# Altium schematic sheet DAP_Main.SchDoc
size A4
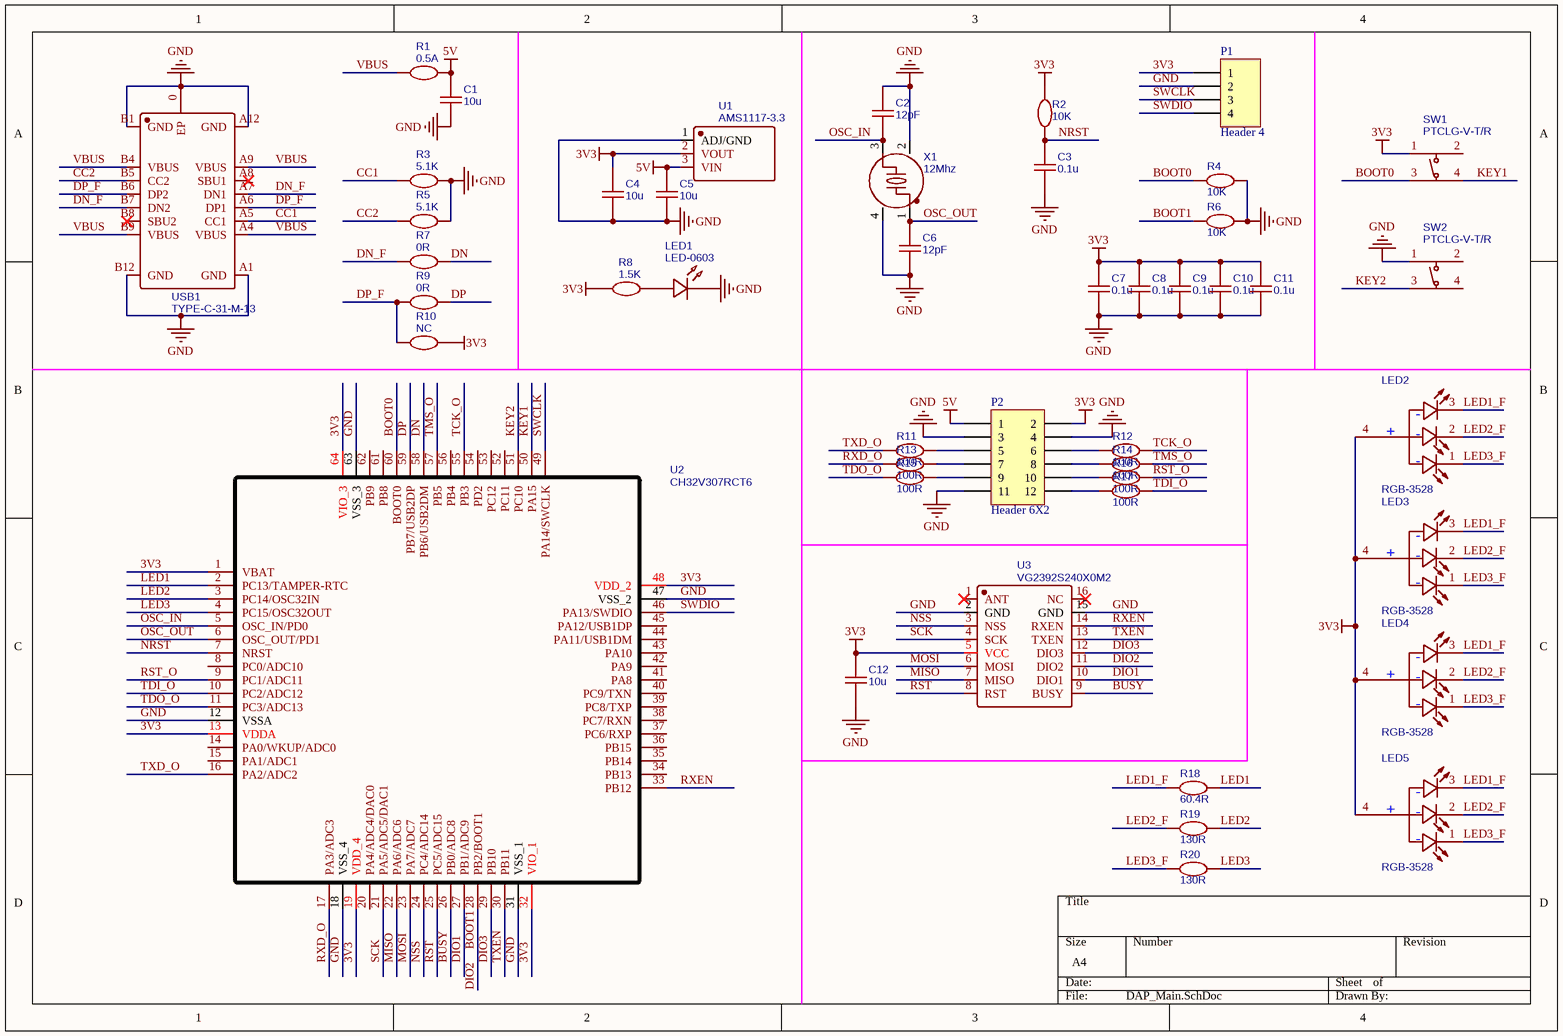
[diagram p0: DAP_Main.SchDoc]

## Parts
C1  10u  [0603_CAP]
C2  12pF  [0402_CAP]
C3  0.1u  [0402_CAP]
C4  10u  [0603_CAP]
C5  10u  [0603_CAP]
C6  12pF  [0402_CAP]
C7  0.1u  [0402_CAP]
C8  0.1u  [0402_CAP]
C9  0.1u  [0402_CAP]
C10  0.1u  [0402_CAP]
C11  0.1u  [0402_CAP]
C12  10u  [0603_CAP]
LED1  LED-0603  [LED0603_RED]
LED2  RGB-3528  [LED-ARRAY-SMD_3528-4P-L3.5-W2.8-TL-RD]
LED3  RGB-3528  [LED-ARRAY-SMD_3528-4P-L3.5-W2.8-TL-RD]
LED4  RGB-3528  [LED-ARRAY-SMD_3528-4P-L3.5-W2.8-TL-RD]
LED5  RGB-3528  [LED-ARRAY-SMD_3528-4P-L3.5-W2.8-TL-RD]
P1  Header 4  [PAD_2.54_1X4]
P2  Header 6X2  [PAD_2.54_2x6_M]
R1  0.5A  [0603_RES]
R2  10K  [0402_RES]
R3  5.1K  [0402_RES]
R4  10K  [0402_RES]
R5  5.1K  [0402_RES]
R6  10K  [0402_RES]
R7  0R  [0402_RES]
R8  1.5K  [0402_RES]
R9  0R  [0402_RES]
R10  NC  [0402_RES]
R11  100R  [0402_RES]
R12  100R  [0402_RES]
R13  100R  [0402_RES]
R14  100R  [0402_RES]
R15  100R  [0402_RES]
R16  100R  [0402_RES]
R17  100R  [0402_RES]
R18  60.4R  [0603_RES]
R19  130R  [0603_RES]
R20  130R  [0603_RES]
SW1  PTCLG-V-T/R  [SW-SMD_4P-L4.7-W3.5-P1.70-LS5.9]
SW2  PTCLG-V-T/R  [SW-SMD_4P-L4.7-W3.5-P1.70-LS5.9]
U1  AMS1117-3.3  [SOT-89-3_L4.5-W2.5-P1.50-LS4.2-BR]
U2  CH32V307RCT6  [CH32V307RCRT6]
U3  VG2392S240X0M2  [WIRELM-SMD_16P-L24.0-W16.0-P2.00_VG2392S240X0M2]
USB1  TYPE-C-31-M-13  [USB-C-SMD_TYPE-C-31-M-13]
X1  12Mhz  [XTAL3225]

## Nets
3V3: C4.1 C7.1 C8.1 C9.1 C10.1 C11.1 C12.1 LED2.4 LED3.4 LED4.4 LED5.4 P1.1 P2.2 R2.2 R8.1 R10.2 SW1.1 U1.2(VOUT) U2.1(VBAT) U2.13(VDDA) U2.19(VDD_4) U2.32(VIO_1) U2.48(VDD_2) U2.64(VIO_3) U3.5(VCC)
5V: C1.2 C5.2 P2.1 R1.2 U1.3(VIN)
GND: C1.1 C2.2 C3.2 C4.2 C5.1 C6.1 C7.2 C8.2 C9.2 C10.2 C11.2 C12.2 LED1.2 P1.2 P2.3 P2.4 P2.11 R3.2 R4.1 R5.2 R6.1 SW2.1 U1.1(ADJ/GND) U2.12(VSSA) U2.18(VSS_4) U2.31(VSS_1) U2.47(VSS_2) U2.63(VSS_3) U3.2(GND) U3.15(GND) USB1.0(EP) USB1.A1(GND) USB1.A12(GND) USB1.B1(GND) USB1.B12(GND) X1.2(GND) X1.4(GND)
BOOT0: R4.2 SW1.3 U2.60(BOOT0)
BOOT1: R6.2 U2.28(PB2/BOOT1) U3.11(DIO2)  [also labelled DIO2]
BUSY: U2.26(PB0/ADC8) U3.9(BUSY)
CC1: R3.1 USB1.A5(CC1)
CC2: R5.1 USB1.B5(CC2)
DIO1: U2.27(PB1/ADC9) U3.10(DIO1)
DIO3: U2.29(PB10) U3.12(DIO3)
DN: R7.2 U2.58(PB6/USB2DM)
DN_F: R7.1 USB1.A7(DN1) USB1.B7(DN2)
DP: R9.2 U2.59(PB7/USB2DP)
DP_F: R9.1 R10.1 USB1.A6(DP1) USB1.B6(DP2)
KEY1: SW1.4 U2.50(PA15)
KEY2: SW2.3 U2.51(PC10)
LED1: R18.1 U2.2(PC13/TAMPER-RTC)
LED1_F: LED2.3 LED3.3 LED4.3 LED5.3 R18.2
LED2: R19.1 U2.3(PC14/OSC32IN)
LED2_F: LED2.2 LED3.2 LED4.2 LED5.2 R19.2
LED3: R20.1 U2.4(PC15/OSC32OUT)
LED3_F: LED2.1 LED3.1 LED4.1 LED5.1 R20.2
MISO: U2.22(PA6/ADC6) U3.7(MISO)
MOSI: U2.23(PA7/ADC7) U3.6(MOSI)
NRST: C3.1 R2.1 U2.7(NRST)
NSS: U2.24(PC4/ADC14) U3.3(NSS)
OSC_IN: C2.1 U2.5(OSC_IN/PD0) X1.3
OSC_OUT: C6.2 U2.6(OSC_OUT/PD1) X1.1
RST: U2.25(PC5/ADC15) U3.8(RST)
RST_O: R16.2 U2.9(PC1/ADC11)
RXD_O: R13.1 U2.17(PA3/ADC3)
RXEN: U2.33(PB12) U3.14(RXEN)
SCK: U2.21(PA5/ADC5/DAC1) U3.4(SCK)
SWCLK: P1.3 U2.49(PA14/SWCLK)
SWDIO: P1.4 U2.46(PA13/SWDIO)
TCK_O: R12.2 U2.55(PB3)
TDI_O: R17.2 U2.10(PC2/ADC12)
TDO_O: R15.1 U2.11(PC3/ADC13)
TMS_O: R14.2 U2.57(PB5)
TXD_O: R11.1 U2.16(PA2/ADC2)
TXEN: U2.30(PB11) U3.13(TXEN)
VBUS: R1.1 USB1.A4(VBUS) USB1.A9(VBUS) USB1.B4(VBUS) USB1.B9(VBUS)
NetLED1_1: LED1.1 R8.2
NetP2_5: P2.5 R11.2
NetP2_6: P2.6 R12.1
NetP2_7: P2.7 R13.2
NetP2_8: P2.8 R14.1
NetP2_9: P2.9 R15.2
NetP2_10: P2.10 R16.1
NetP2_12: P2.12 R17.1

Not connected (* = marked no-connect by the designer): SW1 2; SW2 2 4; U2 8(PC0/ADC10) 14(PA0/WKUP/ADC0) 15(PA1/ADC1) 20(PA4/ADC4/DAC0) 34(PB13) 35(PB14) 36(PB15) 37(PC6/RXP) 38(PC7/RXN) 39(PC8/TXP) 40(PC9/TXN) 41(PA8) 42(PA9) 43(PA10) 44(PA11/USB1DM) 45(PA12/USB1DP) 52(PC11) 53(PC12) 54(PD2) 56(PB4) 61(PB8) 62(PB9); U3 1(ANT)* 16(NC)*; USB1 A8(SBU1)* B8(SBU2)*

## Notes on the sheet
- (in symbol 67-23/R6GHBHC-B01/2T) -; +

## Library data of the parts
C1-C12 = 0.1u: nameAlias: Value(F); Contributor: LCEDA_Lib; spicePre: C; spiceSymbolName: C_0603_US
LED1 = LED-0603_R: BOM_Manufacturer: EVERLIGHT(台湾亿光); BOM_Manufacturer Part: 19-217/R6C-AL1M2VY/3T; Contributor: LCEDA_01; BOM_Supplier Part: C72044; BOM_Supplier: LCSC; spicePre: L; spiceSymbolName: LED-0603_R
LED2-LED5 = 67-23/R6GHBHC-B01/2T: BOM_Manufacturer: Everlight Elec; Contributor: LCSC; BOM_Supplier: LCSC; BOM_Supplier Part: C264607; BOM_Manufacturer Part: 67-23/R6GHBHC-B01/2T; BOM_JLCPCB Part Class: Extended Part; spicePre: L; spiceSymbolName: 67-23/R6GHBHC-B01/2T
P1 = Header 4: Header, 4-Pin; LatestRevisionDate: 17-Jul-2002; LatestRevisionNote: Re-released for DXP Platform.; Publisher: Altium Limited
P2 = Header 6X2: Header, 6-Pin, Dual row; LatestRevisionDate: 17-Jul-2002; LatestRevisionNote: Re-released for DXP Platform.; Publisher: Altium Limited
R1-R20 = 1k: nameAlias: Value(Ω); Contributor: LCEDA_Lib; spicePre: R; spiceSymbolName: R_0603_EU
SW1 SW2 = PTCLG-V-T/R: BOM_Manufacturer: Diptronics; Contributor: LCSC; BOM_Supplier: LCSC; BOM_Supplier Part: C495926; BOM_Manufacturer Part: PTCLG-V-T/R; BOM_JLCPCB Part Class: Extended Part; spicePre: S; spiceSymbolName: PTCLG-V-T/R
U1 = AMS1117-3.3: BOM_Manufacturer: Slkor(SLKORMICRO Elec.); Contributor: LCSC; BOM_Supplier: LCSC; BOM_Supplier Part: C880752; BOM_Manufacturer Part: AMS1117-3.3; BOM_JLCPCB Part Class: Extended Part; spicePre: U; spiceSymbolName: AMS1117-3.3_C880752
U2 = CH32V307RCT6: Contributor: lzfii; BOM_Supplier: LCSC; spicePre: U; spiceSymbolName: CH32V307RCT6 COPY
U3 = VG2392S240X0M2: BOM_Manufacturer: Vollgo(沃进); Contributor: lcsc; BOM_Supplier: LCSC; BOM_Supplier Part: C2976523; BOM_Manufacturer Part: VG2392S240X0M2; spicePre: U; spiceSymbolName: VG2392S240X0M2
USB1 = TYPE-C-31-M-13: BOM_Manufacturer: Korean Hroparts Elec; Contributor: LCSC; BOM_Supplier: LCSC; BOM_Supplier Part: C223906; BOM_Manufacturer Part: TYPE-C-31-M-13; spicePre: U; spiceSymbolName: TYPE-C-31-M-13
X1 = 8MHz: BOM_Manufacturer: YXC扬兴科技; BOM_Manufacturer Part: X32258MSB4SI; nameAlias: Frequency; Contributor: LCSC; BOM_Supplier: LCSC; BOM_Supplier Part: C2682774; BOM_JLCPCB Part Class: Extended Part; spicePre: X; spiceSymbolName: X32258MSB4SI